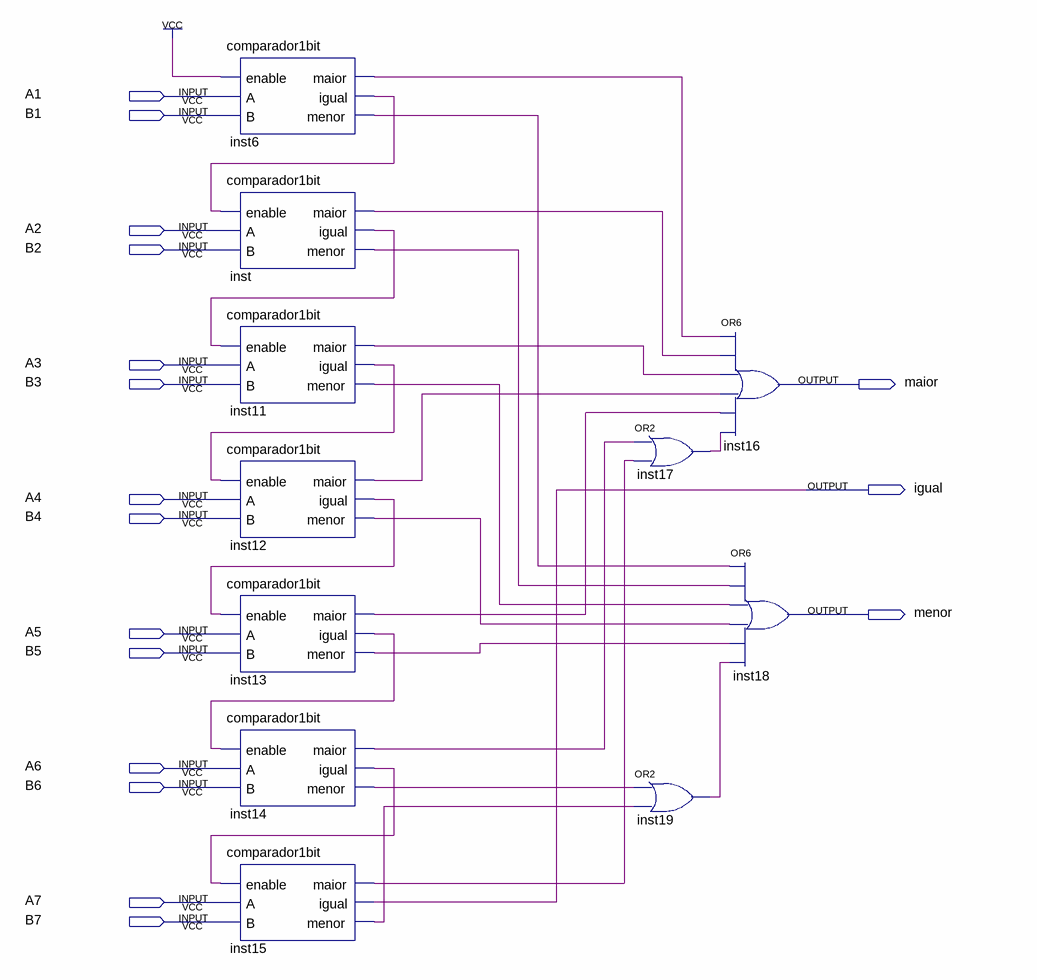
[diagram p0: schematic sheet]
// Quartus schematic comparador7bits.bdf as structural Verilog: 11 symbols, 17 pins
module comparador7bits (
  input  A1,
  input  B1,
  input  A2,
  input  B2,
  input  A3,
  input  B3,
  input  A4,
  input  B4,
  input  A5,
  input  B5,
  input  A6,
  input  B6,
  input  A7,
  input  B7,
  output maior,
  output igual,
  output menor
);

  wire inst6_igual, inst6_maior, inst6_menor, inst11_igual, inst11_maior, inst11_menor, inst12_igual,
       inst12_maior, inst12_menor, inst13_igual, inst13_maior, inst13_menor, inst14_igual, inst14_maior,
       inst14_menor, inst15_maior, inst15_menor, inst17_out, inst19_out, inst_igual, inst_maior, inst_menor;

  comparador1bit inst6 (.enable(1'b1), .A(A1), .B(B1), .maior(inst6_maior), .igual(inst6_igual), .menor(inst6_menor));
  comparador1bit inst (
    .enable(inst6_igual), .A(A2), .B(B2), .maior(inst_maior), .igual(inst_igual), .menor(inst_menor));
  comparador1bit inst11 (
    .enable(inst_igual), .A(A3), .B(B3), .maior(inst11_maior), .igual(inst11_igual), .menor(inst11_menor));
  comparador1bit inst12 (
    .enable(inst11_igual), .A(A4), .B(B4), .maior(inst12_maior), .igual(inst12_igual), .menor(inst12_menor));
  comparador1bit inst13 (
    .enable(inst12_igual), .A(A5), .B(B5), .maior(inst13_maior), .igual(inst13_igual), .menor(inst13_menor));
  comparador1bit inst14 (
    .enable(inst13_igual), .A(A6), .B(B6), .maior(inst14_maior), .igual(inst14_igual), .menor(inst14_menor));
  comparador1bit inst15 (
    .enable(inst14_igual), .A(A7), .B(B7), .maior(inst15_maior), .igual(igual), .menor(inst15_menor));
  or inst17 (inst17_out, inst14_maior, inst15_maior);
  or inst19 (inst19_out, inst14_menor, inst15_menor);
  or inst16 (maior, inst6_maior, inst_maior, inst11_maior, inst12_maior, inst13_maior, inst17_out);
  or inst18 (menor, inst6_menor, inst_menor, inst11_menor, inst12_menor, inst13_menor, inst19_out);
endmodule
